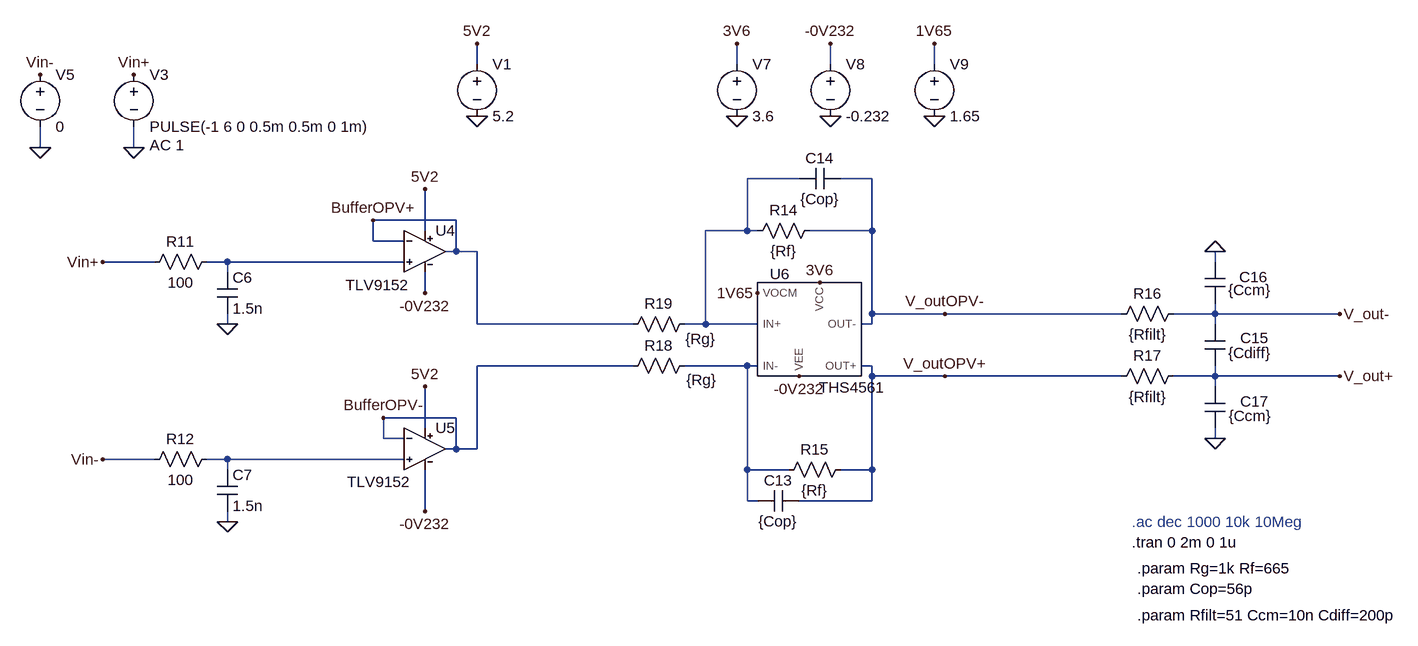
[diagram p0: schematic MAX11331_Rev02.asc]
MAX11331_Rev02.asc, the LTspice schematic file:
Version 4
SHEET 1 1768 944
WIRE -1168 -736 -1168 -768
WIRE -768 -736 -768 -768
WIRE -624 -736 -624 -768
WIRE -464 -736 -464 -768
WIRE -1840 -608 -1840 -640
WIRE -1696 -608 -1696 -640
WIRE -672 -560 -752 -560
WIRE -560 -560 -608 -560
WIRE -1200 -496 -1328 -496
WIRE -1248 -480 -1248 -544
WIRE -752 -480 -752 -560
WIRE -752 -480 -816 -480
WIRE -736 -480 -752 -480
WIRE -560 -480 -560 -560
WIRE -560 -480 -656 -480
WIRE -1328 -464 -1328 -496
WIRE -1280 -464 -1328 -464
WIRE -1200 -448 -1200 -496
WIRE -1200 -448 -1216 -448
WIRE -1168 -448 -1200 -448
WIRE -1664 -432 -1744 -432
WIRE -1552 -432 -1584 -432
WIRE -1280 -432 -1552 -432
WIRE -32 -432 -32 -448
WIRE -1552 -416 -1552 -432
WIRE -1248 -384 -1248 -416
WIRE -560 -352 -560 -480
WIRE -448 -352 -560 -352
WIRE -176 -352 -448 -352
WIRE -32 -352 -32 -368
WIRE -32 -352 -96 -352
WIRE 160 -352 -32 -352
WIRE -1552 -336 -1552 -352
WIRE -1168 -336 -1168 -448
WIRE -928 -336 -1168 -336
WIRE -816 -336 -816 -480
WIRE -816 -336 -848 -336
WIRE -736 -336 -816 -336
WIRE -560 -336 -560 -352
WIRE -560 -336 -576 -336
WIRE -32 -336 -32 -352
WIRE -928 -272 -1168 -272
WIRE -752 -272 -848 -272
WIRE -736 -272 -752 -272
WIRE -560 -272 -576 -272
WIRE -560 -256 -560 -272
WIRE -448 -256 -560 -256
WIRE -176 -256 -448 -256
WIRE -32 -256 -32 -272
WIRE -32 -256 -96 -256
WIRE 160 -256 -32 -256
WIRE -32 -240 -32 -256
WIRE -1200 -192 -1312 -192
WIRE -1248 -176 -1248 -240
WIRE -1312 -160 -1312 -192
WIRE -1280 -160 -1312 -160
WIRE -32 -160 -32 -176
WIRE -1200 -144 -1200 -192
WIRE -1200 -144 -1216 -144
WIRE -1168 -144 -1168 -272
WIRE -1168 -144 -1200 -144
WIRE -1664 -128 -1744 -128
WIRE -1552 -128 -1584 -128
WIRE -1280 -128 -1552 -128
WIRE -1552 -112 -1552 -128
WIRE -752 -112 -752 -272
WIRE -688 -112 -752 -112
WIRE -560 -112 -560 -256
WIRE -560 -112 -608 -112
WIRE -752 -64 -752 -112
WIRE -736 -64 -752 -64
WIRE -560 -64 -560 -112
WIRE -560 -64 -672 -64
WIRE -1248 -48 -1248 -112
WIRE -1552 -32 -1552 -48
FLAG -1696 -608 0
FLAG -1696 -720 Vin+
FLAG -1840 -720 Vin-
FLAG -1840 -608 0
FLAG -768 -656 0
FLAG -624 -656 0
FLAG -768 -768 3V6
FLAG -624 -768 -0V232
FLAG -1248 -544 5V2
FLAG -1248 -240 5V2
FLAG -1248 -48 -0V232
FLAG -1248 -384 -0V232
FLAG -448 -256 V_outOPV+
FLAG -448 -352 V_outOPV-
FLAG -640 -400 3V6
FLAG -32 -448 0
FLAG -32 -160 0
FLAG 160 -256 V_out+
FLAG 160 -352 V_out-
FLAG -464 -656 0
FLAG -464 -768 1V65
FLAG -736 -384 1V65
FLAG -1312 -192 BufferOPV-
FLAG -1328 -496 BufferOPV+
FLAG -672 -256 -0V232
FLAG -1744 -432 Vin+
FLAG -1744 -128 Vin-
FLAG -1552 -336 0
FLAG -1552 -32 0
FLAG -1168 -656 0
FLAG -1168 -768 5V2
SYMBOL voltage -1696 -736 R0
WINDOW 123 24 124 Left 2
WINDOW 39 0 0 Left 2
SYMATTR Value2 AC 1
SYMATTR InstName V3
SYMATTR Value PULSE(-1 6 0 0.5m 0.5m 0 1m)
SYMBOL voltage -1840 -736 R0
WINDOW 123 24 124 Left 2
WINDOW 39 0 0 Left 2
SYMATTR InstName V5
SYMATTR Value 0
SYMBOL voltage -768 -752 R0
WINDOW 123 0 0 Left 2
WINDOW 39 0 0 Left 2
SYMATTR InstName V7
SYMATTR Value 3.6
SYMBOL voltage -624 -752 R0
WINDOW 123 0 0 Left 2
WINDOW 39 0 0 Left 2
SYMATTR InstName V8
SYMATTR Value -0.232
SYMBOL res -640 -496 R90
WINDOW 0 0 56 VBottom 2
WINDOW 3 32 56 VTop 2
SYMATTR InstName R14
SYMATTR Value {Rf}
SYMBOL res -592 -128 R90
WINDOW 0 0 56 VBottom 2
WINDOW 3 32 56 VTop 2
SYMATTR InstName R15
SYMATTR Value {Rf}
SYMBOL res -80 -368 R90
WINDOW 0 0 56 VBottom 2
WINDOW 3 32 56 VTop 2
SYMATTR InstName R16
SYMATTR Value {Rfilt}
SYMBOL res -80 -272 R90
WINDOW 0 0 56 VBottom 2
WINDOW 3 32 56 VTop 2
SYMATTR InstName R17
SYMATTR Value {Rfilt}
SYMBOL cap -672 -80 R90
WINDOW 0 0 32 VBottom 2
WINDOW 3 32 32 VTop 2
SYMATTR InstName C13
SYMATTR Value {Cop}
SYMBOL cap -608 -576 R90
WINDOW 0 0 32 VBottom 2
WINDOW 3 32 32 VTop 2
SYMATTR InstName C14
SYMATTR Value {Cop}
SYMBOL res -832 -288 R90
WINDOW 0 0 56 VBottom 2
WINDOW 3 22 -10 VTop 2
SYMATTR InstName R18
SYMATTR Value {Rg}
SYMBOL cap -48 -336 R0
WINDOW 0 55 21 Left 2
WINDOW 3 36 44 Left 2
SYMATTR InstName C15
SYMATTR Value {Cdiff}
SYMBOL cap -48 -432 R0
WINDOW 0 53 23 Left 2
WINDOW 3 36 43 Left 2
SYMATTR InstName C16
SYMATTR Value {Ccm}
SYMBOL cap -48 -240 R0
WINDOW 0 55 23 Left 2
WINDOW 3 37 45 Left 2
SYMATTR InstName C17
SYMATTR Value {Ccm}
SYMBOL THS4561 -656 -320 R0
WINDOW 3 65 66 Top 2
SYMATTR InstName U6
SYMBOL res -832 -352 R90
WINDOW 0 0 56 VBottom 2
WINDOW 3 23 -9 VTop 2
SYMATTR InstName R19
SYMATTR Value {Rg}
SYMBOL voltage -464 -752 R0
WINDOW 123 0 0 Left 2
WINDOW 39 0 0 Left 2
SYMATTR InstName V9
SYMATTR Value 1.65
SYMBOL TLV9152 -1248 -448 R0
WINDOW 3 -73 36 Top 2
SYMATTR InstName U4
SYMBOL TLV9152 -1248 -144 R0
WINDOW 3 -71 35 Top 2
SYMATTR InstName U5
SYMBOL res -1568 -448 R90
WINDOW 0 0 56 VBottom 2
WINDOW 3 32 56 VTop 2
SYMATTR InstName R11
SYMATTR Value 100
SYMBOL res -1568 -144 R90
WINDOW 0 0 56 VBottom 2
WINDOW 3 32 56 VTop 2
SYMATTR InstName R12
SYMATTR Value 100
SYMBOL cap -1568 -416 R0
SYMATTR InstName C6
SYMATTR Value 1.5n
SYMBOL cap -1568 -112 R0
SYMATTR InstName C7
SYMATTR Value 1.5n
SYMBOL voltage -1168 -752 R0
WINDOW 123 0 0 Left 2
WINDOW 39 0 0 Left 2
SYMATTR InstName V1
SYMATTR Value 5.2
TEXT -160 0 Left 2 !.tran 0 2m 0 1u
TEXT -152 40 Left 2 !.param Rg=1k Rf=665\n.param Cop=56p
TEXT -160 -32 Left 2 ;.ac dec 1000 10k 10Meg
TEXT -152 112 Left 2 !.param Rfilt=51 Ccm=10n Cdiff=200p

The netlist it stands for:
* MAX11331_Rev02.asc
V3 Vin+ 0 PULSE(-1 6 0 0.5m 0.5m 0 1m) AC 1
V5 Vin- 0 0
V7 3V6 0 3.6
V8 -0V232 0 -0.232
R14 V_outOPV- N001 {Rf}
R15 V_outOPV+ N003 {Rf}
R16 V_out- V_outOPV- {Rfilt}
R17 V_out+ V_outOPV+ {Rfilt}
C13 V_outOPV+ N003 {Cop}
C14 V_outOPV- N001 {Cop}
R18 N003 BufferOPV- {Rg}
C15 V_out- V_out+ {Cdiff}
C16 0 V_out- {Ccm}
C17 V_out+ 0 {Ccm}
XU6 N001 N003 V_outOPV+ V_outOPV- 1V65 3V6 -0V232 THS4561  ; pins IN+ IN- OUT+ OUT- VOCM VCC VEE
R19 N001 BufferOPV+ {Rg}
V9 1V65 0 1.65
XU4 N002 BufferOPV+ 5V2 -0V232 BufferOPV+ TLV9152  ; pins IN+ IN- VCC VEE OUT
XU5 N004 BufferOPV- 5V2 -0V232 BufferOPV- TLV9152  ; pins IN+ IN- VCC VEE OUT
R11 N002 Vin+ 100
R12 N004 Vin- 100
C6 N002 0 1.5n
C7 N004 0 1.5n
V1 5V2 0 5.2
.tran 0 2m 0 1u
.param Rg=1k Rf=665
.param Cop=56p
* .ac dec 1000 10k 10Meg
.param Rfilt=51 Ccm=10n Cdiff=200p
.lib ths4561.lib
.lib .\tlv9152.lib
.backanno
.end